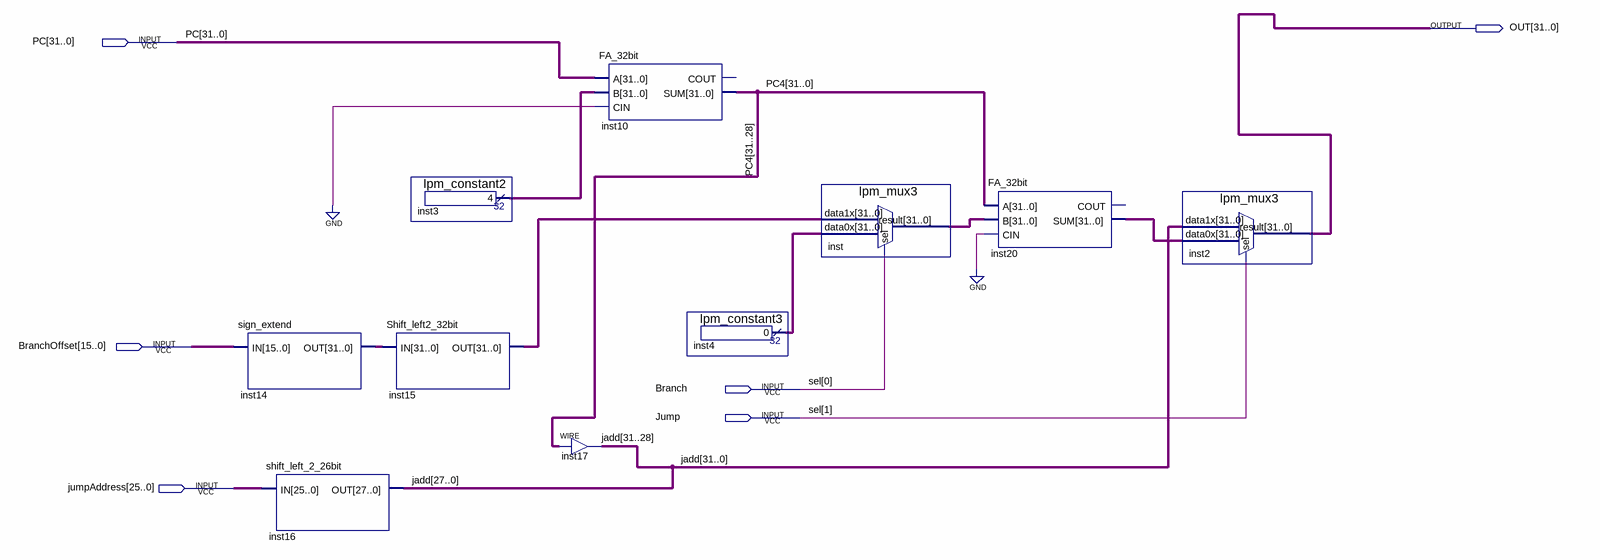
[diagram p0: schematic sheet]
// Quartus schematic PC_comb_logic.bdf as structural Verilog: 10 symbols, 6 pins
module PC_comb_logic (
  input  [31:0] PC,
  input  [15:0] BranchOffset,
  input  Branch,
  input  Jump,
  input  [25:0] jumpAddress,
  output [31:0] OUT
);

  wire [31:0] inst3_result, inst4_result, inst14_out, inst15_out, inst20_sum, inst_result, jadd, PC4;

  sign_extend inst14 (.IN(BranchOffset), .OUT(inst14_out));
  shift_left_2_26bit inst16 (.IN(jumpAddress), .OUT(jadd[27:0]));
  lpm_constant2 inst3 (.result(inst3_result));
  Shift_left2_32bit inst15 (.IN(inst14_out), .OUT(inst15_out));
  FA_32bit inst10 (.A(PC), .B(inst3_result), .CIN(1'b0), .SUM(PC4));  // open: COUT
  assign jadd[31:28] = PC4[31:28];  // WIRE inst17
  lpm_constant3 inst4 (.result(inst4_result));
  lpm_mux3 inst (.data1x(inst15_out), .data0x(inst4_result), .sel(Branch), .result(inst_result));
  FA_32bit inst20 (.A(PC4), .B(inst_result), .CIN(1'b0), .SUM(inst20_sum));  // open: COUT
  lpm_mux3 inst2 (.data1x(jadd), .data0x(inst20_sum), .sel(Jump), .result(OUT));

  // Other names for the same wires on the sheet: sel[1:0] = {Jump, Branch}
endmodule
